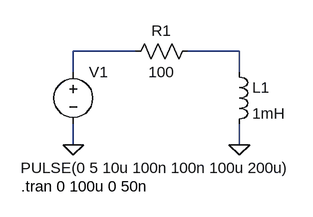
[diagram p0: schematic 03_RL_carga.asc]
03_RL_carga.asc, the LTspice schematic file:
Version 4
SHEET 1 880 680
WIRE 160 112 64 112
WIRE 320 112 240 112
WIRE 64 144 64 112
WIRE 320 144 320 112
WIRE 64 256 64 224
WIRE 320 256 320 224
FLAG 64 256 0
FLAG 320 256 0
SYMBOL ind 304 128 R0
SYMATTR InstName L1
SYMATTR Value 1mH
SYMBOL res 256 96 R90
WINDOW 0 0 56 VBottom 2
WINDOW 3 32 56 VTop 2
SYMATTR InstName R1
SYMATTR Value 100
SYMBOL voltage 64 128 R0
WINDOW 3 -81 164 Left 2
WINDOW 123 0 0 Left 0
WINDOW 39 0 0 Left 0
SYMATTR InstName V1
SYMATTR Value PULSE(0 5 10u 100n 100n 100u 200u)
TEXT -16 320 Left 2 !.tran 0 100u 0 50n

The netlist it stands for:
* 03_RL_carga.asc
L1 N002 0 1mH
R1 N002 N001 100
V1 N001 0 PULSE(0 5 10u 100n 100n 100u 200u)
.tran 0 100u 0 50n
.backanno
.end